# Altium schematic sheet Vsense 0-69.3V.SchDoc: Vsense from 0 to 69.3V
size A4; Date: 2017-07-12; DocumentNumber: 12; Revision: B; SheetNumber: 12; SheetTotal: 16; DesignedBy: Mike MacKay
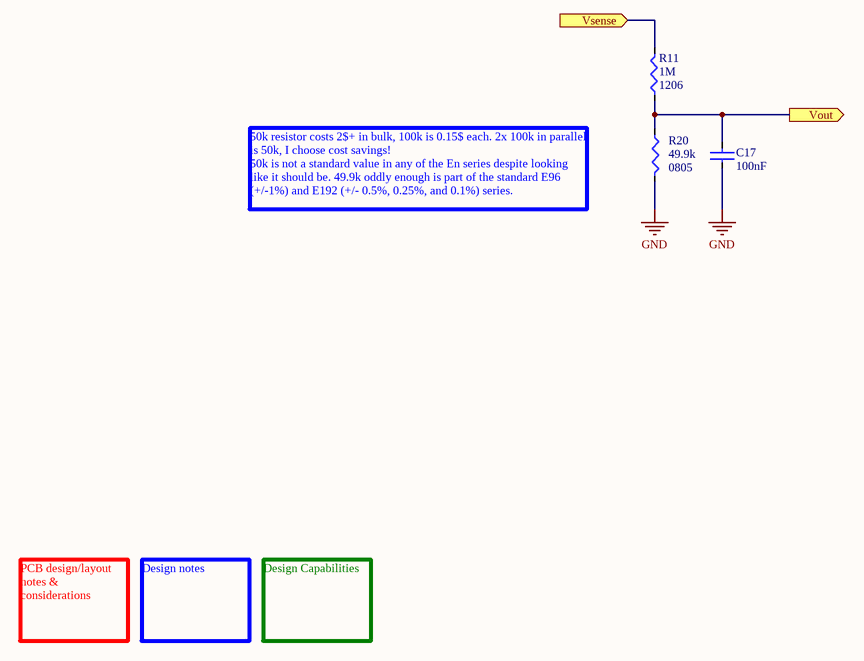
[diagram p0: Vsense 0-69.3V.SchDoc]

## Parts
C17  Capacitance: 100nF  [C0603 - Ceramic]  (hidden comment: 100nF 0603 50V)
R11  Resistance (Ohms): 1M  Supplier Device Package: 1206  [R1210]  (hidden comment: 1M 1206 1%)
R20  Resistance (Ohms): 49.9k  Supplier Device Package: 0805  [R0805]  (hidden comment: Template - Resistor)

## Ports
Vout (out), Vsense (in)

## Nets
GND: C17.2 R20.1
Vout: C17.1 R11.2 R20.2 ; port Vout
Vsense: R11.1 ; port Vsense

## Notes on the sheet
- 50k resistor costs 2$+ in bulk, 100k is 0.15$ each. 2x 100k in parallel is 50k, I choose cost savings!
  50k is not a standard value in any of the En series despite looking like it should be. 49.9k oddly enough is part of the standard E96 (+/-1%) and E192 (+/- 0.5%, 0.25%, and 0.1%) series.
- PCB design/layout notes & considerations
- Design notes
- Design Capabilities
- Repository Version
- BOM/Variant

## Library data of the parts
C17 = 100nF 0603 50V: Manufacturer: Samsung Electro-Mechanics America, Inc; Manufacturer Part Number: CL10B104KB8SFNC; Tolerance: ±10%; Temperature Coefficient: X7R; Value: 100nF 0603 50V; Supplier 1: Digi-Key; RoHS: RoHS Compliant; Category: Capacitors; Stock 1: 1192070; Pricing 1: 1=0.1, 10=0.027, 25=0.0192, 100=0.0125, 500=0.00874, 1000=0.00681 (USD); Packaging: Cut Tape (CT); Voltage - Rated: 50V; Mounting Type: Surface Mount, MLCC; Operating Temperature: -55°C ~ 125°C; Applications: Boardflex Sensitive; Ratings: -; Package / Case: 0603 (1608 Metric); Size / Dimension: 0.063" L x 0.031" W (1.60mm x 0.80mm); Height - Seated (Max): -; Thickness (Max): 0.035" (0.90mm); Lead Spacing: -; Features: Soft Termination; Lead Style: -; ComponentLink1URL: http://www.samsungsem.com/kr/front/downloadcms.do?path=/kr/support/product-search/mlcc/__icsFiles/afieldfile/2014/11/05&fileName=S_CL10B104KB8SFNC.pdf; ComponentLink1Description: http://www.samsungsem.com/kr/front/downloadcms.do?path=/kr/support/product-search/mlcc/__icsFiles/afieldfile/2014/11/05&fileName=S_CL10B104KB8SFNC.pdf; Supplier Part Number 1: 1276-1936-1-ND
R11 = 1M 1206 1%: Resistor; Manufacturer: Yageo; Manufacturer Part Number: RV1206FR-071ML; Power (Watts): 0.25W, 1/4W; Temperature Coefficient: ±200ppm/°C; Value: 1M 1206 1%; Supplier 1: Digi-Key; Supplier Part Number 1: 311-1MNICT-ND; RoHS: RoHS Compliant; Category: Resistors; Stock 1: 79790; Pricing 1: 1=0.34, 10=0.289, 25=0.2104, 50=0.1526, 100=0.1131, 250=0.0868, 500=0.06838, 1000=0.04734 (USD); Packaging: Cut Tape (CT); Part Status: Active; Tolerance: ±1%; Composition: Thick Film; Features: High Voltage, Moisture Resistant; Operating Temperature: -55°C ~ 155°C; Package / Case: 1206; Size / Dimension: 0.122" L x 0.063" W (3.10mm x 1.60mm); Height - Seated (Max): 0.026" (0.65mm); Number of Terminations: 2; Failure Rate: -; ComponentLink1URL: http://www.yageo.com/documents/recent/PYu-RV_51_RoHS_L_6.pdf; ComponentLink1Description: Spec Sheet
R20 = Template - Resistor: Manufacturer: Yageo; Manufacturer Part Number: RC0805FR-0749K9L; Value: 49.9k 0603 1%; Tolerance: ±1%; Power (Watts): 0.125W, 1/8W; Temperature Coefficient: ±100ppm/°C; Supplier 1: Digi-Key; Supplier Part Number 1: 311-49.9KCRCT-ND; RoHS: RoHS Compliant; Category: Resistors; Stock 1: 860512; Pricing 1: 1=0.1, 10=0.019, 25=0.0136, 50=0.0104, 100=0.0077, 250=0.00584, 500=0.00468, 1000=0.00345 (USD); Packaging: Cut Tape (CT); Part Status: Active; Composition: Thick Film; Features: Moisture Resistant; Operating Temperature: -55°C ~ 155°C; Package / Case: 0805 (2012 Metric); Size / Dimension: 0.079" L x 0.049" W (2.00mm x 1.25mm); Height - Seated (Max): 0.024" (0.60mm); Number of Terminations: 2; Failure Rate: -; ComponentLink1URL: http://www.yageo.com/NewPortal/yageodocoutput?fileName=/pdf/R-Chip/PYu-RC_Group_51_RoHS_L_4.pdf; ComponentLink1Description: http://www.yageo.com/NewPortal/yageodocoutput?fileName=/pdf/R-Chip/PYu-RC_Group_51_RoHS_L_4.pdf